# EasyEDA schematic SCH_Meshtastic_FakeTec_PCB_2025-07-15.json
TITLE: Sheet_1; REV: 1.0; Date: 2025-07-08; Sheet: 1/1; Drawn By: pashiran; Company: Your Company
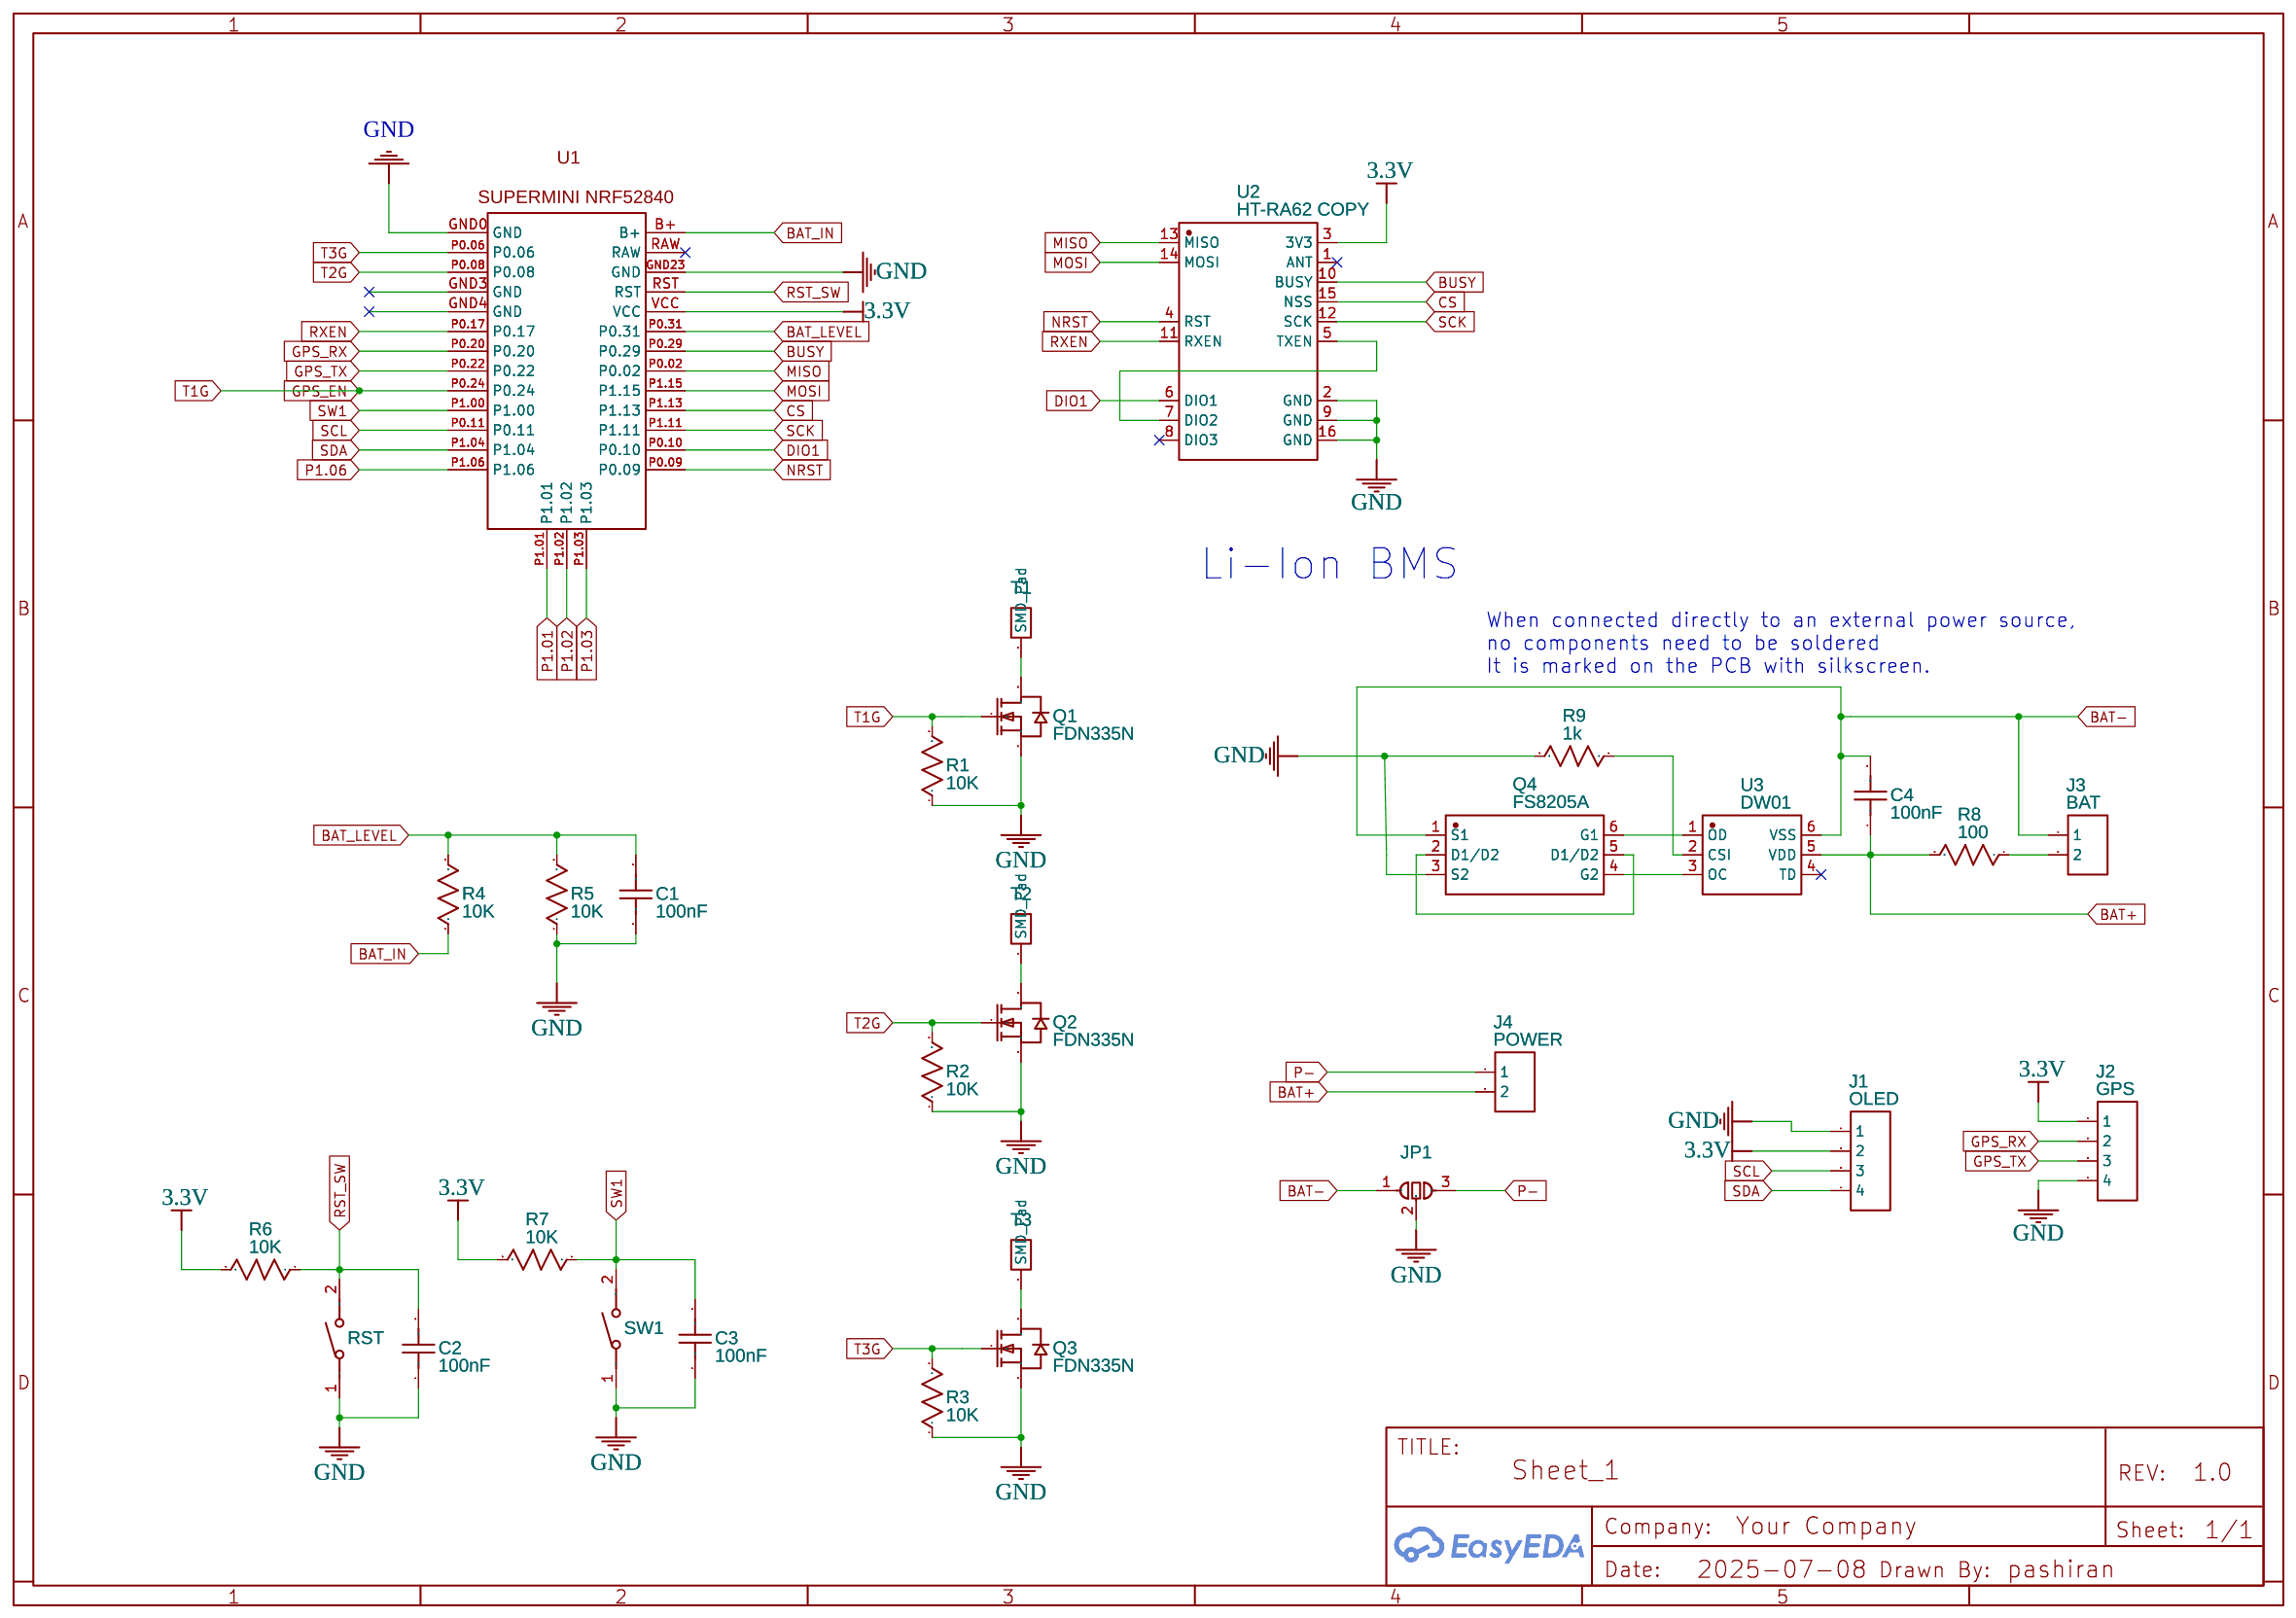
[diagram p0: schematic sheet]

## Parts
C1  100nF  [C0805]
C2  100nF  [C0805]
C3  100nF  [C0805]
C4  100nF  [C0805]
J1  OLED  [HDR-M-2.54_1X4]
J2  GPS  [HDR-M-2.54_1X4]
J3  BAT  [HDR-M-2.54_1X2]
J4  POWER  [HDR-M-2.54_1X2]
JP1  SOLDERJUMPER_3  [JUMPER:SOLDERJUMPER-3_]
Q1  FDN335N  [SOT-23-3_L2.9-W1.3-P1.90-LS2.4-BR]
Q2  FDN335N  [SOT-23-3_L2.9-W1.3-P1.90-LS2.4-BR]
Q3  FDN335N  [SOT-23-3_L2.9-W1.3-P1.90-LS2.4-BR]
Q4  FS8205A  [SOT-23-6_L2.9-W1.6-P0.95-LS2.8-BR]
R1  10K  [R0805]
R2  10K  [R0805]
R3  10K  [R0805]
R4  10K  [R0805]
R5  10K  [R0805]
R6  10K  [R0805]
R7  10K  [R0805]
R8  100  [R0805]
R9  1k  [R0805]
RST  TS-1088-AR02016  [SW-SMD_L3.9-W3.0-P4.45]
SW1  TS-1088-AR02016  [SW-SMD_L3.9-W3.0-P4.45]
T1  SMD_PAD  [PAD_SMD_FOOT_1.6X1.2MM]
T2  SMD_PAD  [PAD_SMD_FOOT_1.6X1.2MM]
T3  SMD_PAD  [PAD_SMD_FOOT_1.6X1.2MM]
U1  SUPERMINI_NRF52840 COPY  [SUPERMINI-NRF52840 COPY]
U2  HT-RA62 COPY  [WIRELM-SMD_HT-RA62 COPY]
U3  DW01  [SOT-23-6_L2.9-W1.6-P0.95-LS2.8-BL]

## Library data of the parts
C1-C4 = C_0805_US: Contributor: LCEDA_Lib
J1 J2 = HDR-M-2.54_1x4: Supplier Part: C124378; Supplier: LCSC; Contributor: LCEDA_Lib
J3 J4 = HDR-M-2.54_1x2: Supplier Part: C124375; Supplier: LCSC; Contributor: LCEDA_Lib
JP1 = SOLDERJUMPER_3: Symbol: SolderJumper_3_Open; Device: SolderJumper_3_Open; Add into BOM: yes; Convert to PCB: yes; Contributor: Prabhu Singh
Q1-Q3 = FDN335N_C5123904: Contributor: lcsc; Supplier: LCSC; Supplier Part: C5123904; Manufacturer: TECH PUBLIC(台舟); JLCPCB Part Class: Extended Part
Q4 = FS8205A_C2830320: Contributor: LCSC; Supplier: LCSC; Supplier Part: C2830320; Manufacturer: TECH PUBLIC(台舟); JLCPCB Part Class: Extended Part
R1-R9 = R_0805_US: Contributor: LCEDA_Lib
RST SW1 = TS-1088-AR02016: Contributor: LCSC; Supplier: LCSC; Supplier Part: C720477; Manufacturer: XUNPU(讯普); JLCPCB Part Class: Basic Part
T1-T3 = SMD_PAD: Contributor: f Beltran; Package Display: No
U1 = SUPERMINI_NRF52840 COPY: Contributor: Tomasz Dobrowolski
U2 = HT-RA62 COPY: Supplier: LCSC; Supplier Part: C9900174816; Manufacturer: null; Manufacturer Part: HT-RA62; Contributor: lcsc
U3 = DW01_C917079: Contributor: LCSC; Supplier: LCSC; Supplier Part: C917079; Manufacturer: JSMSEMI(杰盛微); JLCPCB Part Class: Extended Part

## Nets
3.3V: J1.2 J2.1 R6.2 R7.2 U1.VCC U2.3(3V3)
GND: C1.1 C2.1 C3.1 J1.1 J2.4 JP1.2(C) Q1.2(S) Q2.2(S) Q3.2(S) Q4.3(S2) R1.1 R2.1 R3.1 R5.1 R9.2 RST.1 SW1.1 U1.GND0(GND) U1.GND23(GND) U2.2(GND) U2.9(GND) U2.16(GND)
BAT+: C4.1 J4.2 R8.2 U3.5(VDD)
BAT-: C4.2 J3.1 JP1.1(A) Q4.1(S1) U3.6(VSS)
BAT_IN: R4.1 U1.B+
BAT_LEVEL: C1.2 R4.2 R5.2 U1.P0.31
BUSY: U1.P0.29 U2.10(BUSY)
CS: U1.P1.13 U2.15(NSS)
DIO1: U1.P0.10 U2.6(DIO1)
GPS_EN: Q1.1(G) R1.2 U1.P0.24
GPS_RX: J2.2 U1.P0.20
GPS_TX: J2.3 U1.P0.22
MISO: U1.P0.02 U2.13(MISO)
MOSI: U1.P1.15 U2.14(MOSI)
NRST: U1.P0.09 U2.4(RST)
P1.01: U1.P1.01
P1.02: U1.P1.02
P1.03: U1.P1.03
P1.06: U1.P1.06
P-: J4.1 JP1.3(B)
RST_SW: C2.2 R6.1 RST.2 U1.RST
RXEN: U1.P0.17 U2.11(RXEN)
SCK: U1.P1.11 U2.12(SCK)
SCL: J1.3 U1.P0.11
SDA: J1.4 U1.P1.04
SW1: C3.2 R7.1 SW1.2 U1.P1.00
T2G: Q2.1(G) R2.2 U1.P0.08
T3G: Q3.1(G) R3.2 U1.P0.06
Net-(J3-2): J3.2 R8.1
Net-(Q1-3): Q1.3(D) T1.1(SMD Pad)
Net-(Q2-3): Q2.3(D) T2.1(SMD Pad)
Net-(Q3-3): Q3.3(D) T3.1(SMD Pad)
Net-(Q4-2): Q4.2(D1/D2) Q4.5(D1/D2)
Net-(Q4-4): Q4.4(G2) U3.3(OC)
Net-(Q4-6): Q4.6(G1) U3.1(OD)
Net-(R9-1): R9.1 U3.2(CSI)
Net-(U2-5): U2.5(TXEN) U2.7(DIO2)

Not connected (* = marked no-connect by the designer): U1 GND3(GND) GND4(GND) RAW*; U2 1(ANT)* 8(DIO3)*; U3 4(TD)*

## Notes on the sheet
- Li-Ion BMS
- When connected directly to an external power source,
  no components need to be soldered
  It is marked on the PCB with silkscreen.
